# Altium schematic sheet Front Distribution.SchDoc: Front Power Distribution
size A4
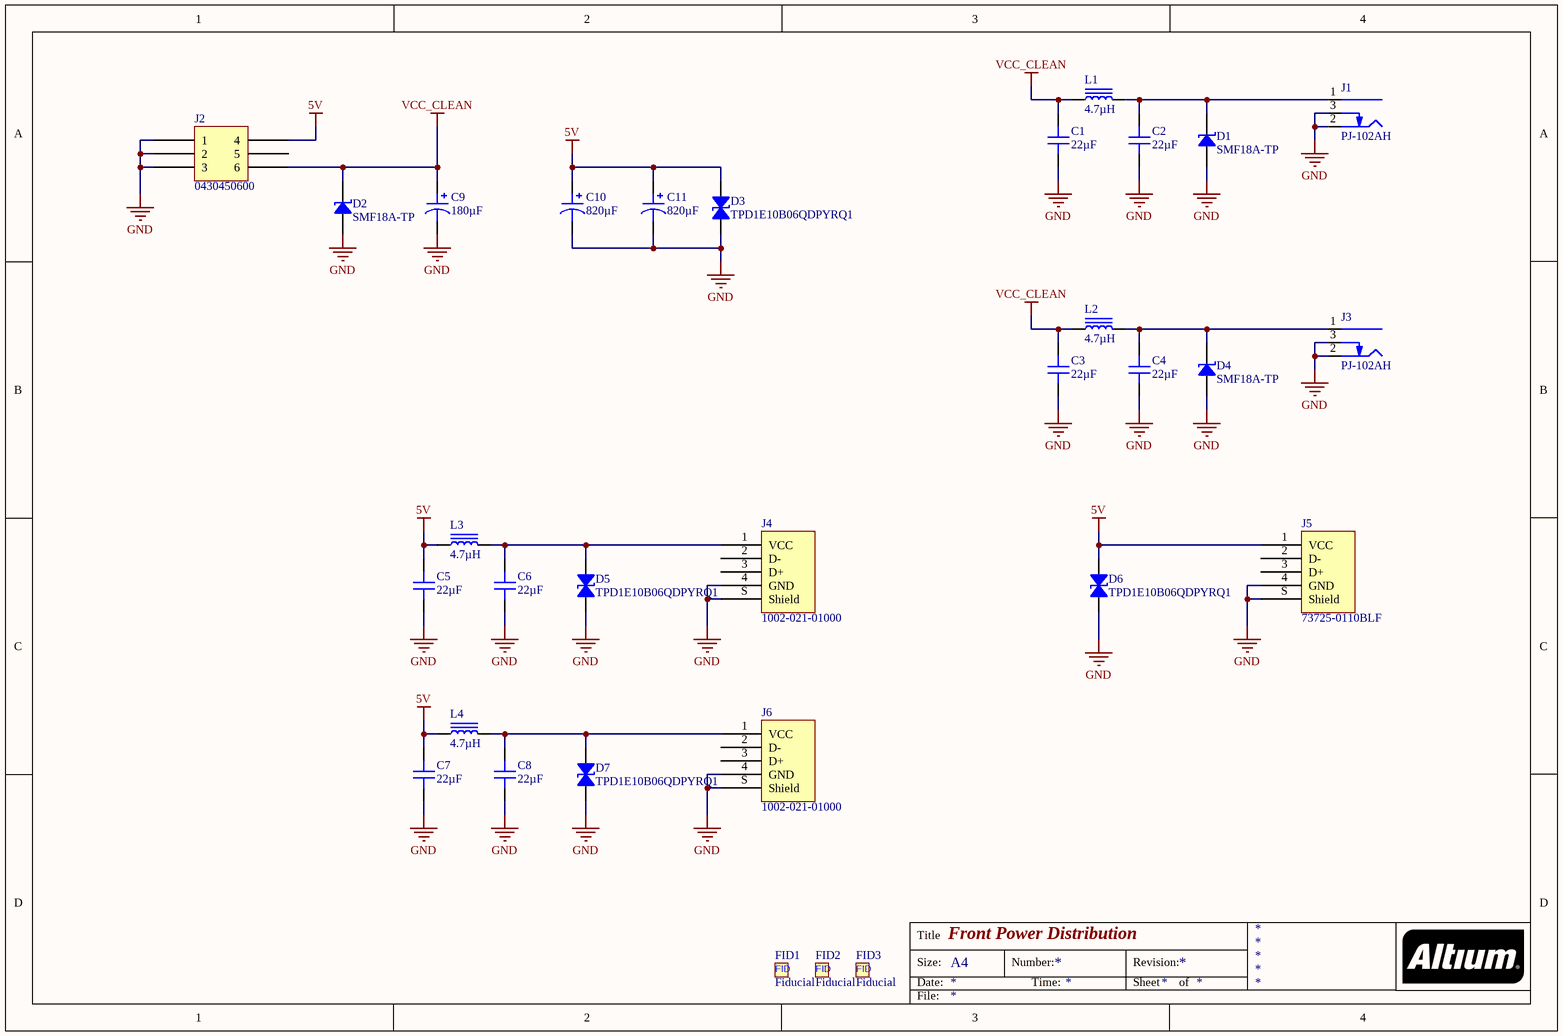
[diagram p0: Front Distribution.SchDoc]

## Parts
C1  22µF  [CAP 1210_3225 - 2.8MM]
C2  22µF  [CAP 1210_3225 - 2.8MM]
C3  22µF  [CAP 1210_3225 - 2.8MM]
C4  22µF  [CAP 1210_3225 - 2.8MM]
C5  22µF  [CAP 1210_3225 - 2.8MM]
C6  22µF  [CAP 1210_3225 - 2.8MM]
C7  22µF  [CAP 1210_3225 - 2.8MM]
C8  22µF  [CAP 1210_3225 - 2.8MM]
C9  180µF  [CAP ALSMD POLY 8.3MM H7.0MM]
C10  820µF  [CAP ALSMD POLY 8.3MM H10.0MM]
C11  820µF  [CAP ALSMD POLY 8.3MM H10.0MM]
D1  SMF18A-TP  [SOD123F]
D2  SMF18A-TP  [SOD123F]
D3  TPD1E10B06QDPYRQ1  [0402]
D4  SMF18A-TP  [SOD123F]
D5  TPD1E10B06QDPYRQ1  [0402]
D6  TPD1E10B06QDPYRQ1  [0402]
D7  TPD1E10B06QDPYRQ1  [0402]
FID1  Fiducial  [Fiducial-1mm]
FID2  Fiducial  [Fiducial-1mm]
FID3  Fiducial  [Fiducial-1mm]
J1  PJ-102AH  [CUI PJ-102AH]
J2  0430450600  [MOLEX MICRO-FIT 3.0 0430450600]
J3  PJ-102AH  [CUI PJ-102AH]
J4  1002-021-01000  [CNC TECH 1002-021-01000]
J5  73725-0110BLF  [AMPHENOL USB 73725-0110BLF]
J6  1002-021-01000  [CNC TECH 1002-021-01000]
L1  4.7µH  [TAIYO YUDEN NRS5030]
L2  4.7µH  [TAIYO YUDEN NRS5030]
L3  4.7µH  [TAIYO YUDEN NRS5030]
L4  4.7µH  [TAIYO YUDEN NRS5030]

## Nets
5V: C5.2 C7.2 C10.1 C11.1 D3.2 D6.2 J2.4 J5.1(VCC) L3.1 L4.1
GND: C1.1 C2.1 C3.1 C4.1 C5.1 C6.1 C7.1 C8.1 C9.2 C10.2 C11.2 D1.1 D2.1 D3.1 D4.1 D5.1 D6.1 D7.1 J1.2(Outer) J1.3(SW) J2.1 J2.2 J2.3 J3.2(Outer) J3.3(SW) J4.4(GND) J4.S(Shield) J5.4(GND) J5.S(Shield) J6.4(GND) J6.S(Shield)
VCC_CLEAN: C1.2 C3.2 C9.1 D2.2 J2.6 L1.1 L2.1
NetC2_2: C2.2 D1.2 J1.1(Centre) L1.2
NetC4_2: C4.2 D4.2 J3.1(Centre) L2.2
NetC6_2: C6.2 D5.2 J4.1(VCC) L3.2
NetC8_2: C8.2 D7.2 J6.1(VCC) L4.2

Not connected (* = marked no-connect by the designer): J2 5; J4 2(D-) 3(D+); J5 2(D-) 3(D+); J6 2(D-) 3(D+)

## Notes on the sheet
- Title
- Size:
- Date:
- A4
- Number:
- Time:
- Revision:
- Sheet
- of
- File:
- (in symbol Fiducial) FID

## Library data of the parts
C1-C8 = CL32A226KAJNNNE: CAP CER 22UF 25V X5R 1210; Manufacturer: Samsung Electro-Mechanics; Tolerance: ±10%; Part Number: CL32A226KAJNNNE; Value: 22µF; Applications: General Purpose; Capacitance: 22µF; ComponentLink1Description: Datasheet; ComponentLink1URL: http://www.samsungsem.com/kr/support/product-search/mlcc/CL32A226KAJNNNE.jsp; ComponentLink2Description: DigiKey Link; ComponentLink2URL: http://digikey.com/product-detail/en/samsung-electro-mechanics/CL32A226KAJNNNE/1276-1101-1-ND/3889187; Device Package: 1210 (3225 Metric); LastUpdated: 21/01/2020 00:30:21; Lifecycle Status: Active; Minimum Order: 1; Mounting Type: Surface Mount, MLCC; Operating Temperature: -55°C ~ 85°C; Package / Case: 1210 (3225 Metric); Packaging: TapeAndReel; PartId: 24102; Part Status: Active; Price: 0.13; Series: CL; Size / Dimension: 0.126" L x 0.098" W (3.20mm x 2.50mm); Supplier 1: DigiKey; Supplier Part Number 1: 1276-1101-1-ND; Temperature Coefficient: X5R; Thickness (Max): 0.106" (2.70mm); Voltage - Rated: 25V
C9 = APXG200ARA181MH70G: CAP ALUM POLY 180UF 20% 20V SMD; Manufacturer: United Chemi-Con; ESR (Equivalent Series Resistance): 25mOhm; Lifetime @ Temp.: 15000 Hrs @ 105°C; Ripple Current @ High Frequency: 3.2A @ 100kHz; Surface Mount Land Size: 0.327" L x 0.327" W (8.30mm x 8.30mm); Type: Polymer; Part Number: APXG200ARA181MH70G; Applications: General Purpose; Capacitance: 180µF; ComponentLink1Description: Datasheet; ComponentLink1URL: http://www.chemi-con.co.jp/cgi-bin/CAT_DB/SEARCH/cat_db_al.cgi?e=e&j=p&pdfname=pxg; ComponentLink2Description: DigiKey Link; ComponentLink2URL: http://digikey.com/product-detail/en/united-chemi-con/APXG200ARA181MH70G/565-4296-1-ND/5824817; Device Package: Radial, Can - SMD; Height - Seated (Max): 0.276" (7.00mm); LastUpdated: 21/01/2020 04:07:43; Lifecycle Status: Active; Minimum Order: 1; Mounting Type: Surface Mount; Operating Temperature: -55°C ~ 105°C; Package / Case: Radial, Can - SMD; Packaging: TapeAndReel; PartId: 2499; Part Status: Active; Price: 0.37; Series: NPCAP™-PXG; Size / Dimension: 0.315" Dia (8.00mm); Supplier 1: DigiKey; Supplier Part Number 1: 565-4296-1-ND; Tolerance: ±20%; Value: 180µF; Voltage - Rated: 20V
C10 C11 = A765KN827M0JLAE010: CAP ALUM POLY 820UF 20% 6.3V SMD; Manufacturer: KEMET; ESR (Equivalent Series Resistance): 10mOhm; Lifetime @ Temp.: 2000 Hrs @ 105°C; Ripple Current @ High Frequency: 3.35A @ 100kHz; Ripple Current @ Low Frequency: 167.5mA @ 120Hz; Surface Mount Land Size: 0.327" L x 0.327" W (8.30mm x 8.30mm); Type: Polymer; Part Number: A765KN827M0JLAE010; Applications: General Purpose; Capacitance: 820µF; ComponentLink1Description: Datasheet; ComponentLink1URL: https://api.kemet.com/component-edge/download/datasheet/A765KN827M0JLAE010.pdf; ComponentLink2Description: DigiKey Link; ComponentLink2URL: http://digikey.com/product-detail/en/kemet/A765KN827M0JLAE010/399-13684-1-ND/6196370; Device Package: Radial, Can - SMD; Height - Seated (Max): 0.394" (10.00mm); LastUpdated: 21/01/2020 04:08:13; Lifecycle Status: Active; Minimum Order: 1; Mounting Type: Surface Mount; Operating Temperature: -55°C ~ 105°C; Package / Case: Radial, Can - SMD; Packaging: TapeAndReel; PartId: 2604; Part Status: Active; Price: 0.33; Series: A765; Size / Dimension: 0.315" Dia (8.00mm); Supplier 1: DigiKey; Supplier Part Number 1: 399-13684-1-ND; Tolerance: ±20%; Value: 820µF; Voltage - Rated: 6.3V
D1 D2 D4 = SMF18A-TP: TVS DIODE 18V 29.2V SOD123FL; Manufacturer: Micro Commercial Co; Current - Peak Pulse (10/1000µs): 6.8A; Power Line Protection: No; Power - Peak Pulse: 200W; Type: Zener; Unidirectional Channels: 1; Voltage - Breakdown (Min): 20V; Part Number: SMF18A-TP; Applications: General Purpose; ComponentLink1Description: Datasheet; ComponentLink1URL: https://www.mccsemi.com/pdf/Products/SMF5.0-170(SOD-123FL)-V2.pdf; ComponentLink2Description: DigiKey Link; ComponentLink2URL: http://digikey.com/product-detail/en/micro-commercial-co/SMF18A-TP/SMF18A-TPMSCT-ND/5114017; Device Package: SOD-123F; LastUpdated: 21/03/2020 01:50:28; Lifecycle Status: Active; Minimum Order: 1; Mounting Type: Surface Mount; Operating Temperature: -65°C ~ 175°C (TA); Package / Case: SOD-123F; Packaging: TapeAndReel; PartId: 10171; Part Status: Active; Price: 0.09; Series: -; Supplier 1: DigiKey; Supplier Part Number 1: SMF18A-TPMSCT-ND; Supplier Device Package: SOD-123FL; Voltage - Clamping (Max) @ Ipp: 29.2V; Voltage - Reverse Standoff (Typ): 18V
D3 D5-D7 = TPD1E10B06QDPYRQ1: TVS DIODE 5.5V 14V 2X1SON; Manufacturer: Texas Instruments; Bidirectional Channels: 1; Capacitance @ Frequency: 12pF @ 1MHz; Current - Peak Pulse (10/1000µs): 6A (8/20µs); Power Line Protection: No; Power - Peak Pulse: 90W; Type: Zener; Voltage - Breakdown (Min): 6V; Voltage - Clamping (Max) @ Ipp: 14V (Typ); Voltage - Reverse Standoff (Typ): 5.5V (Max); Part Number: TPD1E10B06QDPYRQ1; Applications: Automotive; ComponentLink1Description: Datasheet; ComponentLink1URL: http://www.ti.com/general/docs/suppproductinfo.tsp?distId=10&gotoUrl=http%3A%2F%2Fwww.ti.com%2Flit%2Fgpn%2Ftpd1e10b06-q1; ComponentLink2Description: DigiKey Link; ComponentLink2URL: http://digikey.com/product-detail/en/texas-instruments/TPD1E10B06QDPYRQ1/296-TPD1E10B06QDPYRQ1CT-ND/6609868; Device Package: 0402 (1006 Metric); LastUpdated: 21/03/2020 02:05:15; Lifecycle Status: Active; Minimum Order: 1; Mounting Type: Surface Mount; Operating Temperature: -40°C ~ 125°C (TA); Package / Case: 0402 (1006 Metric); Packaging: TapeAndReel; PartId: 10475; Part Status: Active; Price: 0.08; Series: Automotive, AEC-Q101; Supplier 1: DigiKey; Supplier Part Number 1: 296-TPD1E10B06QDPYRQ1CT-ND; Supplier Device Package: 2-X1SON (1x.60)
J1 J3 = PJ-102AH: CONN PWR JACK 2X5.5MM SOLDER; Manufacturer: CUI Devices; Actual Diameter: 0.079" (2.00mm ID), 0.256" (6.50mm OD); Current Rating (Amps): 5A; Gender: Male; Industry Recognized Mating Diameter: 2.00mm ID (0.079"), 5.50mm OD (0.217"); Internal Switch(s): Single Switch, Normally Closed; Material Flammability Rating: UL94 V-0; Mating Length/Depth: 0.354" (9.00mm); Number of Positions/Contacts: 2 Conductors, 3 Contacts; Shielding: Unshielded; Voltage - Rated: 24VDC; Part Number: PJ-102AH; ComponentLink1Description: Datasheet; ComponentLink1URL: https://www.cuidevices.com/product/resource/digikeypdf/pj-102ah.pdf; ComponentLink2Description: DigiKey Link; ComponentLink2URL: //digikey.com/product-detail/en/cui-devices/PJ-102AH/CP-102AH-ND/408448; Connector Type: Jack; LastUpdated: 16/12/2019 19:01:27; Lifecycle Status: 0; Minimum Order: 1; Mounting Type: Through Hole, Right Angle; Packaging: Tray; Part Status: Active; Price: 0.76; Series: -; Supplier 1: DigiKey; Supplier Part Number 1: CP-102AH-ND; Termination: Solder
J2 = 0430450600: CONN HEADER R/A 6POS 3MM; Manufacturer: Molex; Contact Length - Post: 0.125" (3.18mm); Current Rating (Amps): 8A; Material Flammability Rating: UL94 V-0; Number of Positions: 6; Number of Positions Loaded: All; Pitch - Mating: 0.118" (3.00mm); Shrouding: Shrouded - 4 Wall; Style: Board to Cable/Wire; Voltage Rating: 600V; Part Number: 0430450600; ComponentLink1Description: Datasheet; ComponentLink1URL: https://www.molex.com/pdm_docs/ps/PS-43045.pdf; ComponentLink2Description: DigiKey Link; ComponentLink2URL: http://digikey.com/product-detail/en/molex/0430450600/WM1815-ND/252528; Connector Type: Header; Contact Finish - Mating: Tin; Contact Finish - Post: Tin; Contact Finish Thickness - Mating: 100.0µin (2.54µm); Contact Material: Brass; Contact Shape: Square; Contact Type: Male Pin; Fastening Type: Locking Ramp; Features: Board Lock; Insulation Color: Black; Insulation Height: 0.290" (7.37mm); Insulation Material: Liquid Crystal Polymer (LCP), Glass Filled; LastUpdated: 20/03/2020 03:58:57; Lifecycle Status: Active; Minimum Order: 1; Mounting Type: Through Hole, Right Angle; Number of Rows: 2; Packaging: Tray; PartId: 133; Part Status: Active; Price: 1.80; Row Spacing - Mating: 0.118" (3.00mm); Series: Micro-Fit 3.0 43045; Supplier 1: DigiKey; Supplier Part Number 1: WM1815-ND; Termination: Solder
J4 J6 = 1002-021-01000: CONN RCPT USB2.0 TYPEA 4POS VERT; Manufacturer: CNC Tech; Connector Type: USB - A; Current Rating (Amps): 1.5A; Gender: Receptacle; Mating Cycles: 1500; Number of Contacts: 4; Number of Ports: 1; Voltage - Rated: 30V; Part Number: 1002-021-01000; ComponentLink1Description: Datasheet; ComponentLink1URL: http://www.cnctech.us/pdfs/1002-021-01000.pdf; ComponentLink2Description: DigiKey Link; ComponentLink2URL: http://digikey.com/product-detail/en/cnc-tech/1002-021-01000/1175-1265-ND/3466946; Features: Board Lock; LastUpdated: 30/04/2020 12:00:08; Lifecycle Status: Active; Minimum Order: 1; Mounting Feature: Vertical; Mounting Type: Through Hole; Operating Temperature: -55°C ~ 85°C; Packaging: Tray; Part Status: Active; Price: 1.02; Series: -; Specifications: USB 2.0; Supplier 1: DigiKey; Supplier Part Number 1: 1175-1265-ND; Termination: Solder
J5 = 73725-0110BLF: CONN RCPT USB2.0 TYPEA 4POS R/A; Manufacturer: Amphenol ICC (FCI); Connector Type: USB - A; Current Rating (Amps): 2.5A; Gender: Receptacle; Mating Cycles: 1500; Number of Contacts: 4; Number of Ports: 1; Shielding: Shielded; Part Number: 73725-0110BLF; ComponentLink1Description: Datasheet; ComponentLink1URL: http://www.amphenol-icc.com/media/wysiwyg/files/drawing/73725.pdf; ComponentLink2Description: DigiKey Link; ComponentLink2URL: http://digikey.com/product-detail/en/amphenol-icc-fci/73725-0110BLF/609-1041-ND/1001355; Features: Board Lock; LastUpdated: 30/04/2020 11:56:05; Lifecycle Status: Active; Minimum Order: 1; Mounting Feature: Vertical; Mounting Type: Through Hole, Right Angle; Operating Temperature: -55°C ~ 85°C; Packaging: Tube; Part Status: Active; Price: 0.91; Series: 73725; Specifications: USB 2.0; Supplier 1: DigiKey; Supplier Part Number 1: 609-1041-ND; Termination: Solder
L1-L4 = NRS5030T4R7MMGJ: FIXED IND 4.7UH 2.6A 35 MOHM SMD; Manufacturer: Taiyo Yuden; Current - Saturation: 3.1A; DC Resistance (DCR): 35mOhm; Frequency - Self Resonant: 31MHz; Inductance Frequency - Test: 100kHz; Material - Core: Ferrite; Shielding: Shielded; Tolerance: ±20%; Type: Wirewound; Part Number: NRS5030T4R7MMGJ; ComponentLink1Description: Datasheet; ComponentLink1URL: https://www.yuden.co.jp/productdata/catalog/wound04_e.pdf; ComponentLink2Description: DigiKey Link; ComponentLink2URL: http://digikey.com/product-detail/en/taiyo-yuden/NRS5030T4R7MMGJ/587-3461-1-ND/4157801; Current Rating (Amps): 2.6A; Device Package: Nonstandard; Height - Seated (Max): 0.122" (3.10mm); Inductance: 4.7µH; LastUpdated: 30/03/2020 12:35:40; Lifecycle Status: Active; Minimum Order: 1; Mounting Type: Surface Mount; Operating Temperature: -25°C ~ 120°C; Package / Case: Nonstandard; Packaging: TapeAndReel; PartId: 3401; Part Status: Active; Price: 0.17; Series: NR, S Type; Size / Dimension: 0.193" L x 0.193" W (4.90mm x 4.90mm); Supplier 1: DigiKey; Supplier Part Number 1: 587-3461-1-ND; Value: 4.7µH